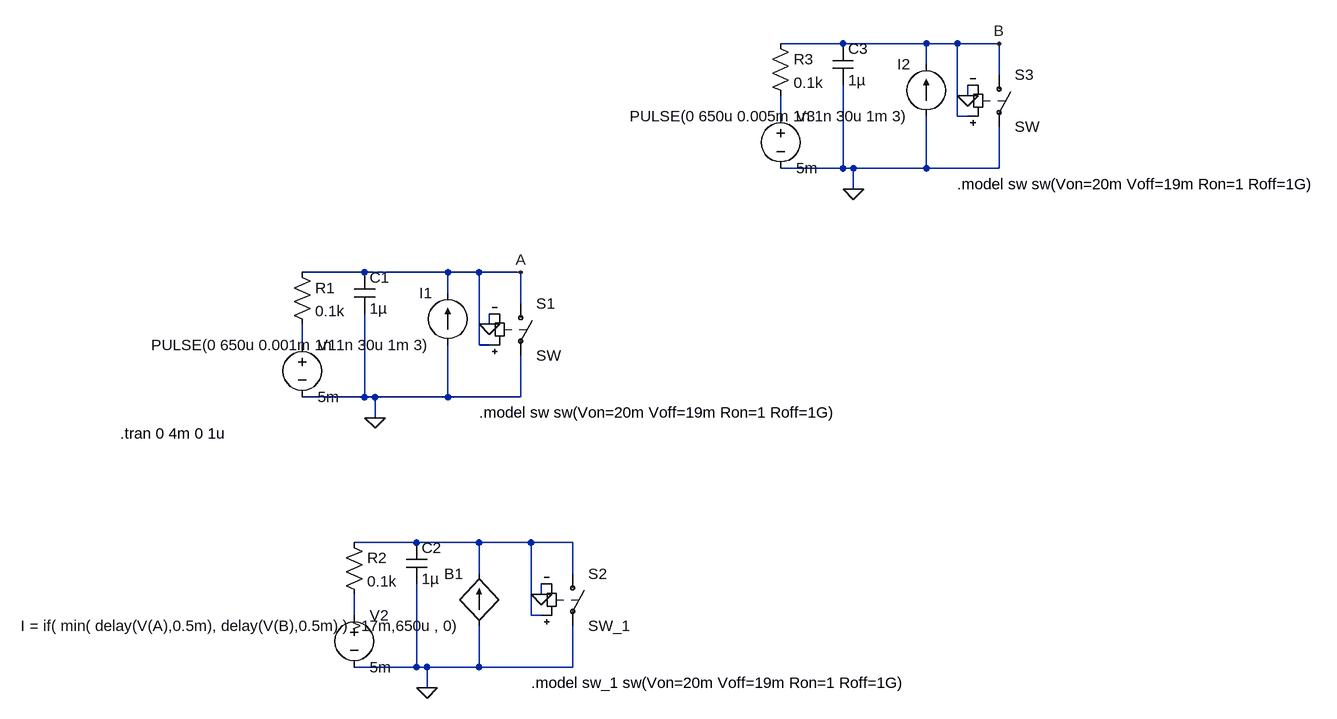
[diagram p0: schematic 2_1feedfoward.asc]
2_1feedfoward.asc, the LTspice schematic file:
Version 4.1
SHEET 1 2940 756
WIRE 928 -256 832 -256
WIRE 1056 -256 928 -256
WIRE 1104 -256 1056 -256
WIRE 1168 -256 1104 -256
WIRE 1056 -224 1056 -256
WIRE 1168 -208 1168 -256
WIRE 1120 -176 1120 -192
WIRE 832 -144 832 -176
WIRE 1104 -144 1104 -256
WIRE 1120 -144 1104 -144
WIRE 928 -64 928 -192
WIRE 928 -64 832 -64
WIRE 944 -64 928 -64
WIRE 1056 -64 1056 -144
WIRE 1056 -64 944 -64
WIRE 1168 -64 1168 -128
WIRE 1168 -64 1056 -64
WIRE 944 -32 944 -64
WIRE 192 96 96 96
WIRE 320 96 192 96
WIRE 368 96 320 96
WIRE 432 96 368 96
WIRE 320 128 320 96
WIRE 432 144 432 96
WIRE 384 176 384 160
WIRE 96 208 96 176
WIRE 368 208 368 96
WIRE 384 208 368 208
WIRE 192 288 192 160
WIRE 192 288 96 288
WIRE 208 288 192 288
WIRE 320 288 320 208
WIRE 320 288 208 288
WIRE 432 288 432 224
WIRE 432 288 320 288
WIRE 208 320 208 288
WIRE 272 512 176 512
WIRE 368 512 272 512
WIRE 448 512 368 512
WIRE 512 512 448 512
WIRE 368 560 368 512
WIRE 512 560 512 512
WIRE 464 592 464 576
WIRE 176 624 176 592
WIRE 448 624 448 512
WIRE 464 624 448 624
WIRE 272 704 272 576
WIRE 272 704 176 704
WIRE 288 704 272 704
WIRE 368 704 368 640
WIRE 368 704 288 704
WIRE 512 704 512 640
WIRE 512 704 368 704
WIRE 288 736 288 704
FLAG 208 320 0
FLAG 384 176 0
FLAG 288 736 0
FLAG 464 592 0
FLAG 944 -32 0
FLAG 1120 -176 0
FLAG 432 96 A
FLAG 1168 -256 B
SYMBOL res 80 80 R0
SYMATTR InstName R1
SYMATTR Value 0.1k
SYMBOL cap 176 96 R0
SYMATTR InstName C1
SYMATTR Value 1µ
SYMBOL voltage 96 192 R0
SYMATTR InstName V1
SYMATTR Value 5m
SYMBOL current 320 208 R180
WINDOW 0 24 80 Left 2
WINDOW 3 24 0 Left 2
WINDOW 123 0 0 Left 0
WINDOW 39 0 0 Left 0
SYMATTR InstName I1
SYMATTR Value PULSE(0 650u 0.001m 1n 1n 30u 1m 3)
SYMBOL sw 432 128 R0
SYMATTR InstName S1
SYMBOL res 160 496 R0
SYMATTR InstName R2
SYMATTR Value 0.1k
SYMBOL cap 256 512 R0
SYMATTR InstName C2
SYMATTR Value 1µ
SYMBOL voltage 176 608 R0
SYMATTR InstName V2
SYMATTR Value 5m
SYMBOL sw 512 544 R0
SYMATTR InstName S2
SYMATTR Value SW_1
SYMBOL bi 368 640 R180
WINDOW 0 24 80 Left 2
WINDOW 3 24 0 Left 2
SYMATTR InstName B1
SYMATTR Value I = if( min( delay(V(A),0.5m), delay(V(B),0.5m) ) >17m,650u , 0)
SYMBOL res 816 -272 R0
SYMATTR InstName R3
SYMATTR Value 0.1k
SYMBOL cap 912 -256 R0
SYMATTR InstName C3
SYMATTR Value 1µ
SYMBOL voltage 832 -160 R0
SYMATTR InstName V3
SYMATTR Value 5m
SYMBOL current 1056 -144 R180
WINDOW 0 24 80 Left 2
WINDOW 3 24 0 Left 2
WINDOW 123 0 0 Left 0
WINDOW 39 0 0 Left 0
SYMATTR InstName I2
SYMATTR Value PULSE(0 650u 0.005m 1n 1n 30u 1m 3)
SYMBOL sw 1168 -224 R0
SYMATTR InstName S3
TEXT -184 344 Left 2 !.tran 0 4m 0 1u
TEXT 368 312 Left 2 !.model sw sw(Von=20m Voff=19m Ron=1 Roff=1G)
TEXT 448 728 Left 2 !.model sw_1 sw(Von=20m Voff=19m Ron=1 Roff=1G)
TEXT 1104 -40 Left 2 !.model sw sw(Von=20m Voff=19m Ron=1 Roff=1G)

The netlist it stands for:
* 2_1feedfoward.asc
R1 A N002 0.1k
C1 A 0 1µ
V1 N002 0 5m
I1 0 A PULSE(0 650u 0.001m 1n 1n 30u 1m 3)
S1 A 0 A 0 SW
R2 N003 N004 0.1k
C2 N003 0 1µ
V2 N004 0 5m
S2 N003 0 N003 0 SW_1
B1 0 N003 I = if( min( delay(V(A),0.5m), delay(V(B),0.5m) ) >17m,650u , 0)
R3 B N001 0.1k
C3 B 0 1µ
V3 N001 0 5m
I2 0 B PULSE(0 650u 0.005m 1n 1n 30u 1m 3)
S3 B 0 B 0 SW
.tran 0 4m 0 1u
.model sw sw(Von=20m Voff=19m Ron=1 Roff=1G)
.model sw_1 sw(Von=20m Voff=19m Ron=1 Roff=1G)
.model sw sw(Von=20m Voff=19m Ron=1 Roff=1G)
.backanno
.end